# EAGLE schematic layout (EAGLE 7.6.0)
Alexa lamp with brightness control
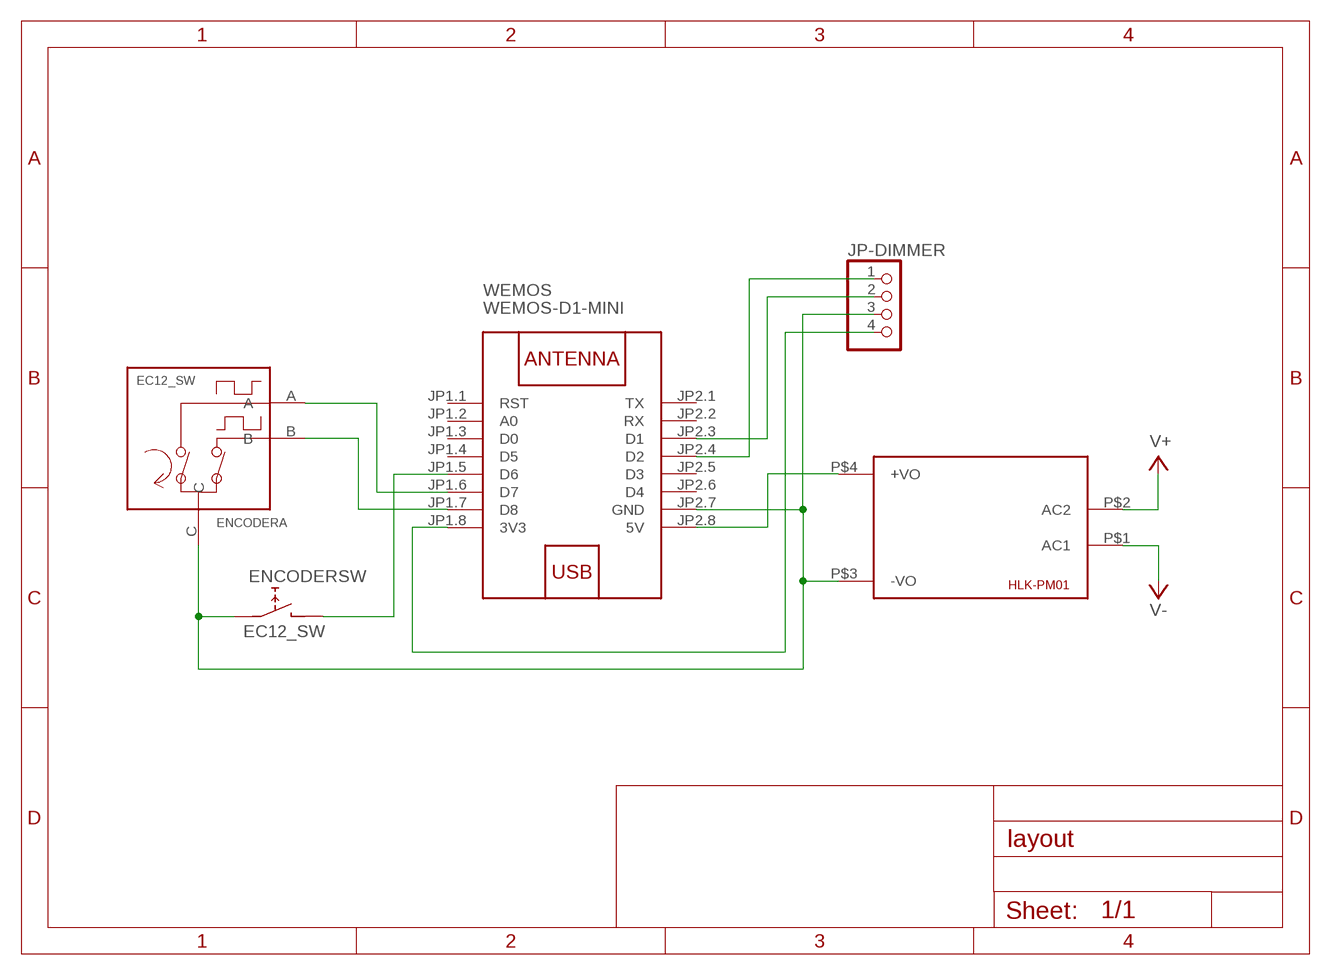
[diagram p0: schematic, sheet 1]

## Parts
ENCODER  EC12_SW  [EC12S]
HLK-PM01  HLK-PM013W  [HLK-PM01]
JP-DIMMER  PINHD-1X4  [1X04]
WEMOS  WEMOS-D1-MINI  [WEMOS-D1-MINI]

## Nets
N$1: ENCODER.C(A:C) ENCODER.D(SW:D) HLK-PM01.P$3(-VO) JP-DIMMER.3 WEMOS.JP2.7(GND)
N$2: HLK-PM01.P$4(+VO) WEMOS.JP2.8(5V)
N$3: ENCODER.A(A:A) WEMOS.JP1.6(D7)
N$4: ENCODER.B(A:B) WEMOS.JP1.7(D8)
N$5: ENCODER.E(SW:E) WEMOS.JP1.5(D6)
N$6: JP-DIMMER.4 WEMOS.JP1.8(3V3)
N$7: JP-DIMMER.2 WEMOS.JP2.3(D1)
N$8: JP-DIMMER.1 WEMOS.JP2.4(D2)
V+: HLK-PM01.P$2(AC2)
V-: HLK-PM01.P$1(AC1)
Unconnected: WEMOS.JP1.1(RST) WEMOS.JP1.2(A0) WEMOS.JP1.3(D0) WEMOS.JP1.4(D5) WEMOS.JP2.1(TX) WEMOS.JP2.2(RX) WEMOS.JP2.5(D3) WEMOS.JP2.6(D4)

## Library data of the parts
ENCODER = rotary-encoder:EC12_SW
HLK-PM01 = HLK-PM01:HLK-PM01: Hi-Link Power Supply HLK-PM01 3W Author: Ahmed Said <https://github.com/AhmedSaid/EAGLELibraries>
JP-DIMMER = pinhead:PINHD-1X4: PIN HEADER
WEMOS = diy-modules:WEMOS-D1-MINI: WEMOS D1 mini: Mini Wi-Fi Board based on ESP-8266 device More details can be found here: https://www.wemos.cc/product/d1-mini.html Click here to find device on ebay.com <http://www.ebay.com/sch/wemos+d1+mini+nodemcu>